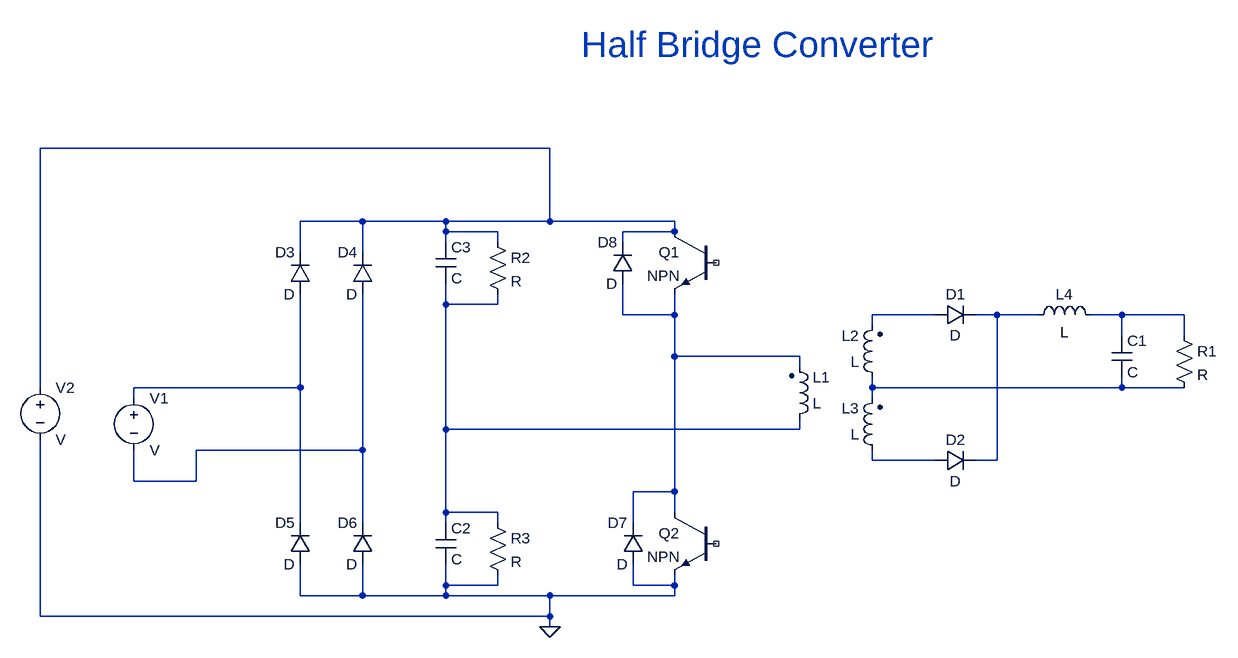
[diagram p0: schematic Half Bridge Converter.asc]
Half Bridge Converter.asc, the LTspice schematic file:
Version 4
SHEET 1 880 680
WIRE -224 -880 -1008 -880
WIRE -512 -768 -608 -768
WIRE -384 -768 -512 -768
WIRE -224 -768 -224 -880
WIRE -224 -768 -384 -768
WIRE -32 -768 -224 -768
WIRE -384 -752 -384 -768
WIRE -304 -752 -384 -752
WIRE -32 -752 -32 -768
WIRE -32 -752 -112 -752
WIRE -384 -736 -384 -752
WIRE -304 -736 -304 -752
WIRE -112 -736 -112 -752
WIRE -608 -720 -608 -768
WIRE -512 -720 -512 -768
WIRE -384 -640 -384 -672
WIRE -304 -640 -304 -656
WIRE -304 -640 -384 -640
WIRE -112 -624 -112 -672
WIRE -32 -624 -32 -656
WIRE -32 -624 -112 -624
WIRE 368 -624 272 -624
WIRE 464 -624 432 -624
WIRE 528 -624 464 -624
WIRE 656 -624 608 -624
WIRE 752 -624 656 -624
WIRE 272 -608 272 -624
WIRE 656 -592 656 -624
WIRE 752 -592 752 -624
WIRE -32 -560 -32 -624
WIRE 160 -560 -32 -560
WIRE 160 -544 160 -560
WIRE -1008 -512 -1008 -880
WIRE -608 -512 -608 -656
WIRE -608 -512 -864 -512
WIRE 272 -512 272 -528
WIRE 656 -512 656 -528
WIRE 656 -512 272 -512
WIRE 752 -512 656 -512
WIRE -864 -496 -864 -512
WIRE 272 -496 272 -512
WIRE -384 -448 -384 -640
WIRE 160 -448 160 -464
WIRE 160 -448 -384 -448
WIRE -512 -416 -512 -656
WIRE -512 -416 -768 -416
WIRE 272 -400 272 -416
WIRE 368 -400 272 -400
WIRE 464 -400 464 -624
WIRE 464 -400 432 -400
WIRE -864 -368 -864 -416
WIRE -768 -368 -768 -416
WIRE -768 -368 -864 -368
WIRE -32 -352 -32 -560
WIRE -32 -352 -96 -352
WIRE -384 -320 -384 -448
WIRE -304 -320 -384 -320
WIRE -32 -320 -32 -352
WIRE -608 -304 -608 -512
WIRE -512 -304 -512 -416
WIRE -384 -304 -384 -320
WIRE -304 -304 -304 -320
WIRE -96 -304 -96 -352
WIRE -384 -208 -384 -240
WIRE -304 -208 -304 -224
WIRE -304 -208 -384 -208
WIRE -96 -208 -96 -240
WIRE -32 -208 -32 -224
WIRE -32 -208 -96 -208
WIRE -608 -192 -608 -240
WIRE -512 -192 -512 -240
WIRE -512 -192 -608 -192
WIRE -384 -192 -384 -208
WIRE -384 -192 -512 -192
WIRE -224 -192 -384 -192
WIRE -32 -192 -32 -208
WIRE -32 -192 -224 -192
WIRE -1008 -160 -1008 -432
WIRE -224 -160 -224 -192
WIRE -224 -160 -1008 -160
WIRE -224 -144 -224 -160
FLAG -224 -144 0
SYMBOL ind2 144 -448 M180
WINDOW 0 36 80 Left 2
WINDOW 3 36 40 Left 2
SYMATTR InstName L1
SYMBOL ind2 288 -512 R180
WINDOW 0 36 80 Left 2
WINDOW 3 36 40 Left 2
SYMATTR InstName L2
SYMBOL ind2 288 -400 R180
WINDOW 0 36 80 Left 2
WINDOW 3 36 40 Left 2
SYMATTR InstName L3
SYMBOL diode 368 -608 R270
WINDOW 0 32 32 VTop 2
WINDOW 3 0 32 VBottom 2
SYMATTR InstName D1
SYMBOL diode 368 -384 R270
WINDOW 0 32 32 VTop 2
WINDOW 3 0 32 VBottom 2
SYMATTR InstName D2
SYMBOL ind 512 -608 R270
WINDOW 0 32 56 VTop 2
WINDOW 3 5 56 VBottom 2
SYMATTR InstName L4
SYMBOL cap 640 -592 R0
SYMATTR InstName C1
SYMBOL res 736 -608 R0
SYMATTR InstName R1
SYMBOL npn 32 -752 M0
SYMATTR InstName Q1
SYMBOL npn 32 -320 M0
SYMATTR InstName Q2
SYMBOL cap -400 -304 R0
SYMATTR InstName C2
SYMBOL cap -400 -736 R0
SYMATTR InstName C3
SYMBOL res -320 -752 R0
SYMATTR InstName R2
SYMBOL res -320 -320 R0
SYMATTR InstName R3
SYMBOL diode -592 -656 R180
WINDOW 0 24 64 Left 2
WINDOW 3 24 0 Left 2
SYMATTR InstName D3
SYMBOL diode -496 -656 R180
WINDOW 0 24 64 Left 2
WINDOW 3 24 0 Left 2
SYMATTR InstName D4
SYMBOL diode -592 -240 R180
WINDOW 0 24 64 Left 2
WINDOW 3 24 0 Left 2
SYMATTR InstName D5
SYMBOL diode -496 -240 R180
WINDOW 0 24 64 Left 2
WINDOW 3 24 0 Left 2
SYMATTR InstName D6
SYMBOL voltage -864 -512 R0
SYMATTR InstName V1
SYMBOL diode -80 -240 R180
WINDOW 0 24 64 Left 2
WINDOW 3 24 0 Left 2
SYMATTR InstName D7
SYMBOL diode -96 -672 R180
WINDOW 0 24 64 Left 2
WINDOW 3 24 0 Left 2
SYMATTR InstName D8
SYMBOL voltage -1008 -528 R0
SYMATTR InstName V2
TEXT -176 -1040 Left 5 ;Half Bridge Converter

The netlist it stands for:
* Half Bridge Converter.asc
L1 N002 N003 L
L2 N008 N004 L
L3 N010 N008 L
D1 N004 N005 D
D2 N010 N005 D
L4 N005 N006 L
C1 N006 N008 C
R1 N006 N008 R
Q1 N001 NC_01 N003 0 NPN
Q2 N003 NC_02 0 0 NPN
C2 N002 0 C
C3 N001 N002 C
R2 N001 N002 R
R3 N002 0 R
D3 N007 N001 D
D4 N009 N001 D
D5 0 N007 D
D6 0 N009 D
V1 N007 N009 V
D7 0 N003 D
D8 N003 N001 D
V2 N001 0 V
.model D D
.lib standard.dio
.model NPN NPN
.model PNP PNP
.lib standard.bjt
* Half Bridge Converter
.backanno
.end